# Altium schematic sheet MCU.SchDoc
size B; SheetNumber: 3; SheetTotal: 15; SPICEModelCacheWVSDJHDF: <root> / <DocumentId>WVSDJHDF</DocumentId> / </root>
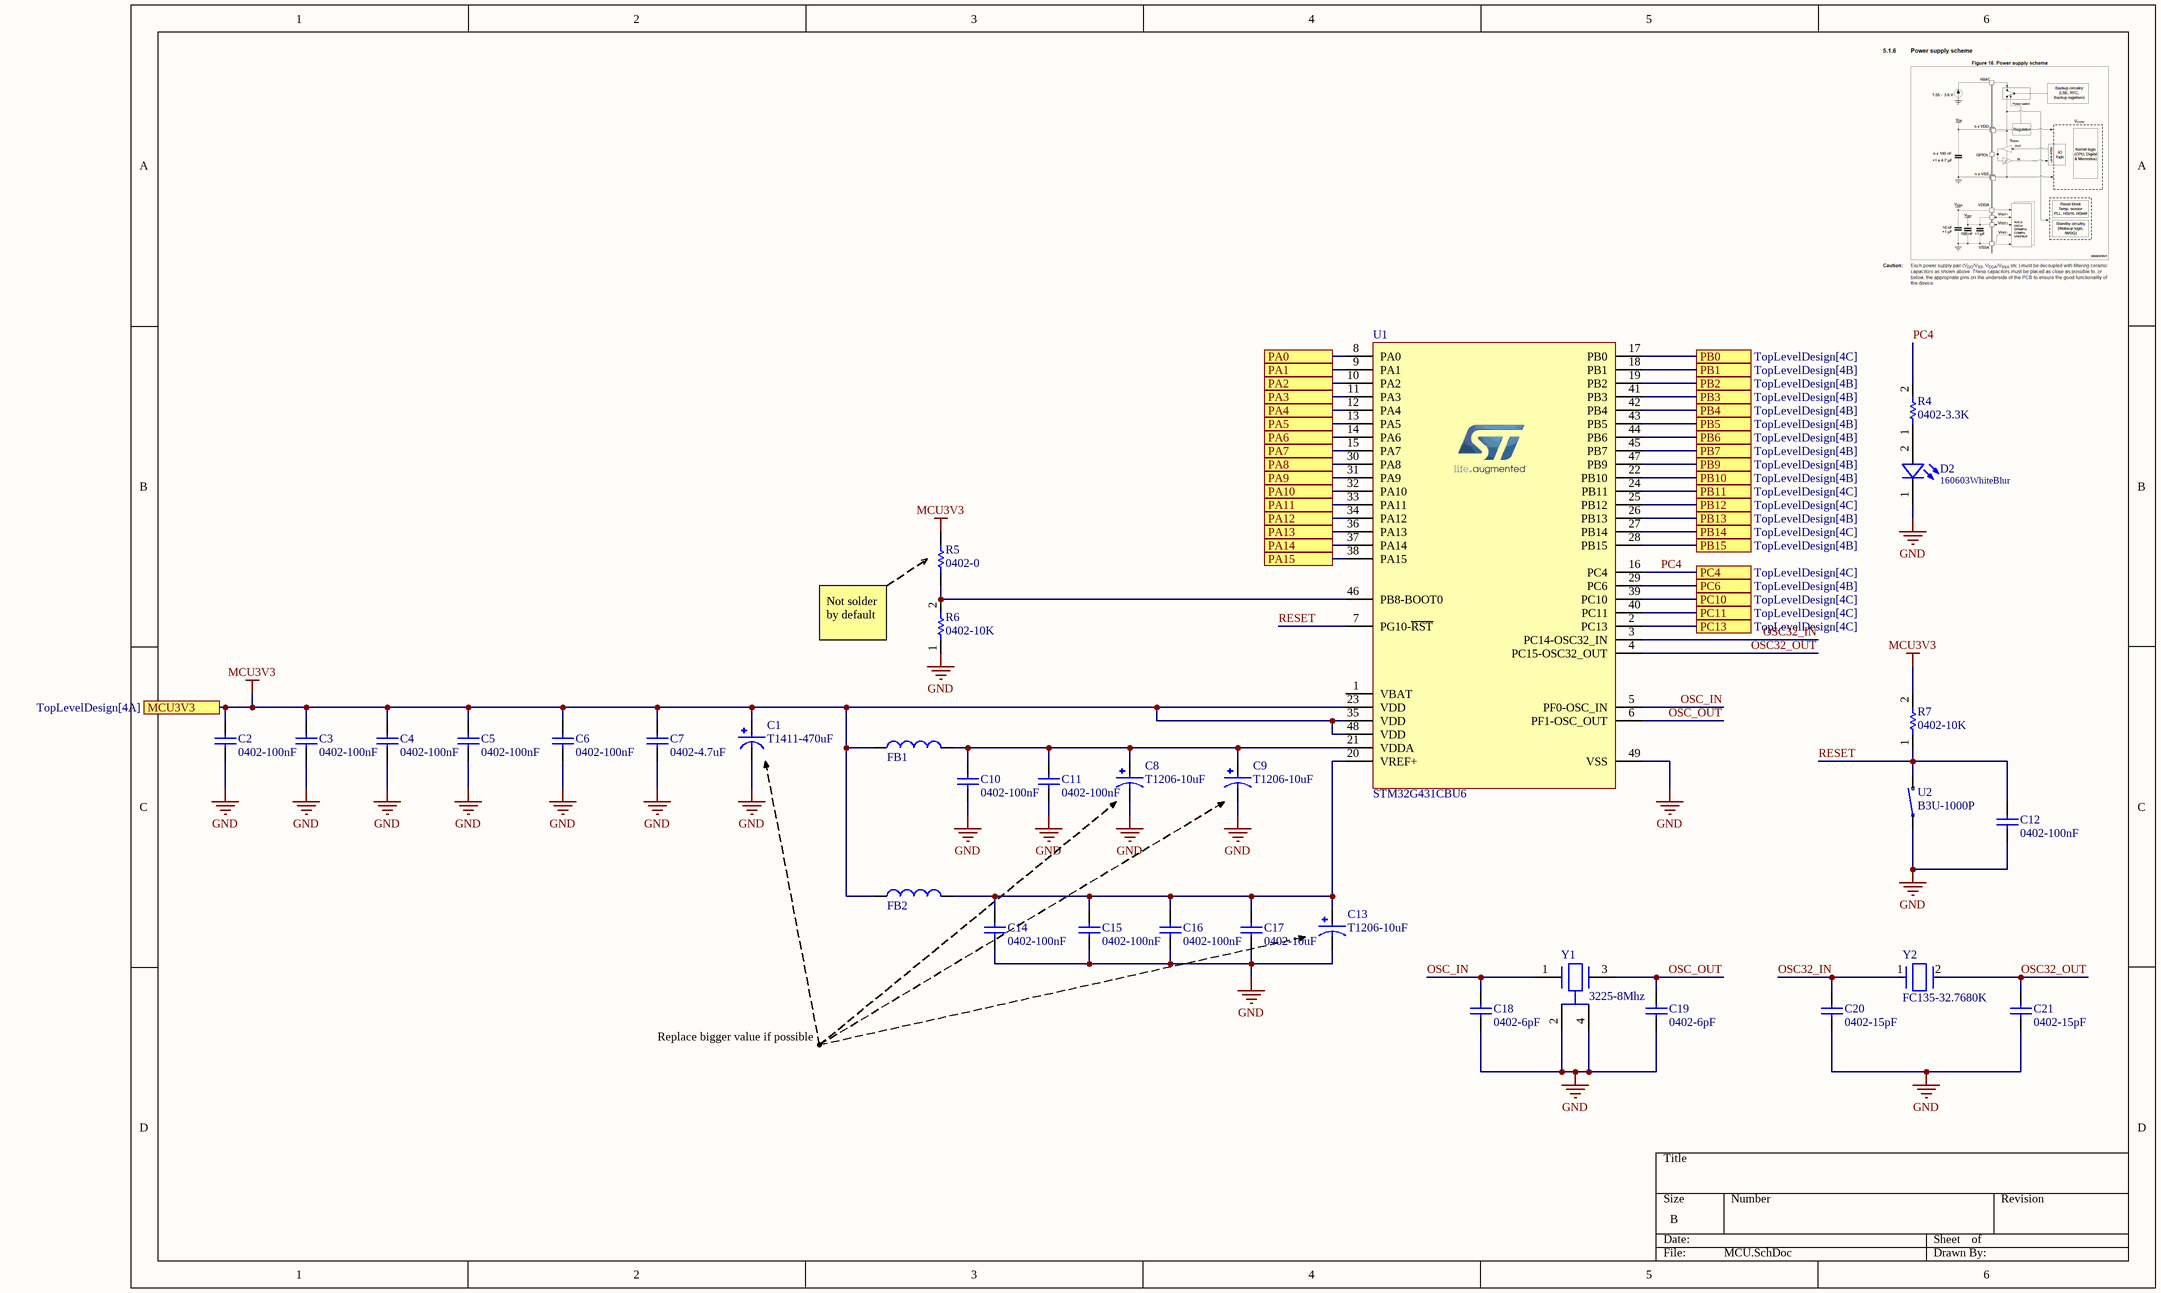
[diagram p0: MCU.SchDoc]

## Parts
C1  T1411-470uF  [CAPPC3528X210N]
C2  0402-100nF  [CAPC0402(1005)60_N]
C3  0402-100nF  [CAPC0402(1005)60_N]
C4  0402-100nF  [CAPC0402(1005)60_N]
C5  0402-100nF  [CAPC0402(1005)60_N]
C6  0402-100nF  [CAPC0402(1005)60_N]
C7  0402-4.7uF  [CAPC0402(1005)60_N]
C8  T1206-10uF  [CAPMP3216X180N]
C9  T1206-10uF  [CAPMP3216X180N]
C10  0402-100nF  [CAPC0402(1005)60_N]
C11  0402-100nF  [CAPC0402(1005)60_N]
C12  0402-100nF  [CAPC0402(1005)60_N]
C13  T1206-10uF  [CAPMP3216X180N]
C14  0402-100nF  [CAPC0402(1005)60_N]
C15  0402-100nF  [CAPC0402(1005)60_N]
C16  0402-100nF  [CAPC0402(1005)60_N]
C17  0402-10uF  [CAPC0402(1005)60_N]
C18  0402-6pF  [CAPC0402(1005)60_N]
C19  0402-6pF  [CAPC0402(1005)60_N]
C20  0402-15pF  [CAPC0402(1005)60_N]
C21  0402-15pF  [CAPC0402(1005)60_N]
D2  160603WhiteBlur  [WL-SMCW_0603_H=0.7mm]
FB1  03060360110225  [FER_0603]  (value not drawn)
FB2  03060360110225  [FER_0603]  (value not drawn)
R4  0402-3.3K  [R-0402-10K]
R5  0402-0  [R-0402-1K]
R6  0402-10K  [R-0402-10K]
R7  0402-10K  [R-0402-10K]
U1  STM32G431CBU6  [QFN50P700X700X60-49N]
U2  B3U-1000P  [SODFL4025X160N]
Y1  3225-8Mhz  [FP-NX3225SA-MFG]
Y2  FC135-32.7680K  [FP-FC-135-MFG]

## Ports
MCU3V3 (see TopLevelDesign[4A]), PA0 (see TopLevelDesign[4C]), PA1 (see TopLevelDesign[4C]), PA2 (see TopLevelDesign[4D]), PA3 (see TopLevelDesign[4D]), PA4 (see TopLevelDesign[4C]), PA5 (see TopLevelDesign[4C]), PA6 (see TopLevelDesign[4C]), PA7 (see TopLevelDesign[4C]), PA8 (see TopLevelDesign[4C]), PA9 (see TopLevelDesign[4C]), PA10 (see TopLevelDesign[4B]), PA11 (see TopLevelDesign[4B]), PA12 (see TopLevelDesign[4B]), PA13 (see TopLevelDesign[4B]), PA14 (see TopLevelDesign[4B]), PA15 (see TopLevelDesign[4B]), PB0 (see TopLevelDesign[4C]), PB1 (see TopLevelDesign[4B]), PB2 (see TopLevelDesign[4B]), PB3 (see TopLevelDesign[4B]), PB4 (see TopLevelDesign[4B]), PB5 (see TopLevelDesign[4B]), PB6 (see TopLevelDesign[4B]), PB7 (see TopLevelDesign[4B]), PB9 (see TopLevelDesign[4B]), PB10 (see TopLevelDesign[4B]), PB11 (see TopLevelDesign[4C]), PB12 (see TopLevelDesign[4C]), PB13 (see TopLevelDesign[4B]), PB14 (see TopLevelDesign[4C]), PB15 (see TopLevelDesign[4B]), PC4 (see TopLevelDesign[4C]), PC6 (see TopLevelDesign[4B]), PC10 (see TopLevelDesign[4C]), PC11 (see TopLevelDesign[4C]), PC13 (see TopLevelDesign[4C])

## Nets
GND: C1.2 C2.1 C3.1 C4.1 C5.1 C6.1 C7.1 C8.2 C9.2 C10.1 C11.1 C12.1 C13.2 C14.1 C15.1 C16.1 C17.1 C18.1 C19.1 C20.1 C21.1 D2.1(K) R6.1 U1.49(VSS) U2.1 Y1.2(GND) Y1.4(GND)
MCU3V3: C1.1 C2.2 C3.2 C4.2 C5.2 C6.2 C7.2 FB1.1 FB2.1 R5.2 R7.2 U1.23(VDD) U1.35(VDD) U1.48(VDD) ; port MCU3V3
OSC32_IN: C20.2 U1.3(PC14-OSC32_IN) Y2.1
OSC32_OUT: C21.2 U1.4(PC15-OSC32_OUT) Y2.2
OSC_IN: C18.2 U1.5(PF0-OSC_IN) Y1.1
OSC_OUT: C19.2 U1.6(PF1-OSC_OUT) Y1.3
PA0: U1.8(PA0) ; port PA0
PA1: U1.9(PA1) ; port PA1
PA2: U1.10(PA2) ; port PA2
PA3: U1.11(PA3) ; port PA3
PA4: U1.12(PA4) ; port PA4
PA5: U1.13(PA5) ; port PA5
PA6: U1.14(PA6) ; port PA6
PA7: U1.15(PA7) ; port PA7
PA8: U1.30(PA8) ; port PA8
PA9: U1.31(PA9) ; port PA9
PA10: U1.32(PA10) ; port PA10
PA11: U1.33(PA11) ; port PA11
PA12: U1.34(PA12) ; port PA12
PA13: U1.36(PA13) ; port PA13
PA14: U1.37(PA14) ; port PA14
PA15: U1.38(PA15) ; port PA15
PB0: U1.17(PB0) ; port PB0
PB1: U1.18(PB1) ; port PB1
PB2: U1.19(PB2) ; port PB2
PB3: U1.41(PB3) ; port PB3
PB4: U1.42(PB4) ; port PB4
PB5: U1.43(PB5) ; port PB5
PB6: U1.44(PB6) ; port PB6
PB7: U1.45(PB7) ; port PB7
PB9: U1.47(PB9) ; port PB9
PB10: U1.22(PB10) ; port PB10
PB11: U1.24(PB11) ; port PB11
PB12: U1.25(PB12) ; port PB12
PB13: U1.26(PB13) ; port PB13
PB14: U1.27(PB14) ; port PB14
PB15: U1.28(PB15) ; port PB15
PC4: R4.2 U1.16(PC4) ; port PC4
PC6: U1.29(PC6) ; port PC6
PC10: U1.39(PC10) ; port PC10
PC11: U1.40(PC11) ; port PC11
PC13: U1.2(PC13) ; port PC13
RESET: C12.2 R7.1 U1.7(PG10-~{RST}) U2.2
NetC8_1: C8.1 C9.1 C10.2 C11.2 FB1.2 U1.21(VDDA)
NetC13_1: C13.1 C14.2 C15.2 C16.2 C17.2 FB2.2 U1.20(VREF+)
NetD2_2: D2.2(A) R4.1
NetR5_1: R5.1 R6.2 U1.46(PB8-BOOT0)

Not connected (* = marked no-connect by the designer): U1 1(VBAT)

## Notes on the sheet
- Not solder by default
- Replace bigger value if possible

## Library data of the parts
C1 = CMP-001-00375-1: 470 µF Molded Tantalum Polymer Capacitor 25 V 1411 (3528 Metric), 1210 150mOhm @ 100kHz; Value: 470µF; MP: TCJB106M025R0150; MF: AVX; SnapEDA_Link: https://www.snapeda.com/parts/TCJB106M025R0150/AVX/view-part/?ref=snap; Check_prices: https://www.snapeda.com/parts/TCJB106M025R0150/AVX/view-part/?ref=eda; Pins: 2; Design Item ID: TCJB106M025R0150; Component Type: Standard; Source: TCJB106M025R0150.SchLib; Case/Package: 1210 AVX
C2-C6 C10-C12 C14-C16 = CMP-001-00354-3: Capacitor 100nF 0402; Tolerance: 20%; Voltage Rating (DC): 4V; Dielectric: X5R; Series: M; RoHS Compliant: Yes; Max Operating Temperature: 85°C; Length: 0.039inch; Thickness: 0.028inch; Mount: Surface Mount; Min Operating Temperature: -55°C; Height: 0.5mm; Packaging: Tape and Reel; Construction: Flat; Termination: SMD/SMT; Source: 0402-10uF.SchLib; Design Item ID: CMP-1034-02139-2; Case/Package: 0402; Voltage Rating: 4V; Pins: 2; Value: 100nF; Width: 0.02inch; Component Type: Standard; Package Quantity: 1; Halogen Free: Halogen Free; Case Code (Metric): 1005
C7 = CMP-001-00364-1: Capacitor 4.7uF 0402; Voltage Rating: 4V; Tolerance: 20%; Dielectric: X5R; Value: 4.7µF; Series: M; Width: 0.02inch; Halogen Free: Halogen Free; Construction: Flat; Pins: 2; Min Operating Temperature: -55°C; RoHS Compliant: Yes; Max Operating Temperature: 85°C; Thickness: 0.028inch; Package Quantity: 1; Mount: Surface Mount; Component Type: Standard; Packaging: Tape and Reel; Case Code (Metric): 1005; Case/Package: 0402; Voltage Rating (DC): 4V; Length: 0.039inch; Source: 0402-10uF.SchLib; Termination: SMD/SMT; Design Item ID: CMP-1034-02139-2; Height: 0.5mm
C8 C9 C13 = CMP-001-00370-3: Tantalum Capacitors - Polymer SMD 6.3V 47uF 1206 10% ESR=150mOhms; MP: T543A476K006ATW150; MF: KEMET; Value: 10µF; Source: T543A476K006ATW150.SchLib; Design Item ID: T543A476K006ATW150; Check_prices: https://www.snapeda.com/parts/T543A476K006ATW150/KEMET/view-part/?ref=eda; Case/Package: SMD-2 Kemet; Component Type: Standard; SnapEDA_Link: https://www.snapeda.com/parts/T543A476K006ATW150/KEMET/view-part/?ref=snap; Pins: 2
C17 = CMP-001-00352-3: Capacitor 10uF 0402s; Tolerance: 20%; Value: 10µF; Dielectric: X5R; Voltage Rating (DC): 4V; Width: 0.02inch; Packaging: Tape and Reel; RoHS Compliant: Yes; Series: M; Mount: Surface Mount; Termination: SMD/SMT; Source: 0402-10uF.SchLib; Design Item ID: CMP-1034-02139-2; Min Operating Temperature: -55°C; Construction: Flat; Component Type: Standard; Case Code (Metric): 1005; Length: 0.039inch; Height: 0.5mm; Pins: 2; Thickness: 0.028inch; Voltage Rating: 4V; Package Quantity: 1; Max Operating Temperature: 85°C; Halogen Free: Halogen Free; Case/Package: 0402
C18 C19 = CMP-001-00362-3: Capacitor 6pF 0402; Dielectric: X5R; Voltage Rating: 4V; Tolerance: 20%; Source: 0402-10uF.SchLib; Case Code (Metric): 1005; Case/Package: 0402; Mount: Surface Mount; Component Type: Standard; Packaging: Tape and Reel; Construction: Flat; RoHS Compliant: Yes; Series: M; Width: 0.02inch; Max Operating Temperature: 85°C; Min Operating Temperature: -55°C; Pins: 2; Height: 0.5mm; Package Quantity: 1; Length: 0.039inch; Thickness: 0.028inch; Value: 6pF; Design Item ID: CMP-1034-02139-2; Halogen Free: Halogen Free; Termination: SMD/SMT; Voltage Rating (DC): 4V
C20 C21 = CMP-001-00374-1: Capacitor 15pF 0402; Voltage Rating: 4V; Tolerance: 20%; Dielectric: X5R; Packaging: Tape and Reel; Length: 0.039inch; Max Operating Temperature: 85°C; Design Item ID: CMP-1034-02139-2; Value: 15pF; Min Operating Temperature: -55°C; Case Code (Metric): 1005; Voltage Rating (DC): 4V; Case/Package: 0402; RoHS Compliant: Yes; Height: 0.5mm; Halogen Free: Halogen Free; Construction: Flat; Thickness: 0.028inch; Component Type: Standard; Source: 0402-10uF.SchLib; Termination: SMD/SMT; Mount: Surface Mount; Width: 0.02inch; Pins: 2; Series: M; Package Quantity: 1
D2 = CMP-004-00095-1: WL-SMCW SMT Mono-color Chip LED Blur, size 0603, White; ComponentLink3Description: Supplier 2 URL; Design Item ID: 160603WhiteBlur; Component Type: Standard; Size: 0603; Supplier 1 SN: 755-SMLEN3WBC8W1; Color: White; Supplier 3 Name: ICDayRoi; Supplier 3 URL: N/A; Pins: 2; Supplier 2 URL: https://www.digikey.com/en/products/detail/qt-brightek-qtb/QBLP601-IW/4814655; ComponentLink1URL: N/A; ComponentLink3URL: https://www.digikey.com/en/products/detail/qt-brightek-qtb/QBLP601-IW/4814655; Supplier 1 URL: https://www.mouser.vn/ProductDetail/ROHM-Semiconductor/SMLEN3WBC8W1?qs=W0yvOO0ixfGun78rr9Unsw%3D%3D; ComponentLink2URL: https://www.mouser.vn/ProductDetail/ROHM-Semiconductor/SMLEN3WBC8W1?qs=W0yvOO0ixfGun78rr9Unsw%3D%3D; ComponentLink4Description: Supplier 3 URL; Supplier 1 Name: Mouser; Supplier 3 SN: N/A; ComponentLink4URL: N/A; Source: WL-SMCW_0603.SchLib; Supplier 2 SN: 1516-1057-2-ND; Value: White; Supplier 2 Name: Digi-Key; ComponentLink2Description: Supplier 1 URL; ComponentLink1Description: Datasheet link; Type: Blur
FB1 FB2 = CMP-006-00090-1: Ferrite, 0603, 600 Ohms, 300 mA; Manufacture Name: Wurth Elektronik; Manufacture SN: 742792651; Maximum DC Resistance: 200 mOhms; Maximum DC Current: 1 A; Test Frequency: 100MHz; Tolerance: 25%; Design Item ID: 03060360110225; Impedance: 600 Ohms; Supplier 2 URL: N/A; Supplier 1 URL: https://www.mouser.com/ProductDetail/Wurth-Elektronik/742792651?qs=sGAEpiMZZMt1hubY80%2Fs8M60rIzA20dgTaAssd1%2FEf4%3D&utm_source=mouser-refine-download&utm_medium=file&utm_campaign=742792651&utm_content=Wurth-Elektronik; Supplier 1 SN: 710-742792651; Size: 0603; Operating Temperature: -55 to +125degC; Supplier 1 Name: Mouser; Packaging: Tape and Reel; Pins: 2; Supplier 2 SN: N/A; Supplier 3 Name: thegioiic; Supplier 3 URL: N/A; Supplier 2 Name: Digi-Key; Source: Ferrite_Bead_0603.SchLib; Mounting Technology: SMT; Supplier 3 SN: N/A; Component Type: Standard
R4 = CMP-009-00688-1: RES 0402 3.3K; Value: 3.3k
R5 = CMP-009-00678-4: 0402Resistor 0 Ohm; Value: 0
R6 R7 = CMP-009-00675-4: RES 0402 10K; Value: 10k
U1 = CMP-031-00017-3: ARMÂ® CortexÂ®-M4F STM32G4 Microcontroller IC 32-Bit Single-Core 170MHz 128KB (128K x 8) FLASH 48-UFQFPN (7x7); MF: STMicroelectronics; Case/Package: UFQFPN-48 STMicroelectronics; MP: STM32G431CBU6; Check_prices: https://www.snapeda.com/parts/STM32G431CBU6/STMicroelectronics/view-part/?ref=eda; Source: STM32G431CBU6.SchLib; Pins: 49; Value: *; SnapEDA_Link: https://www.snapeda.com/parts/STM32G431CBU6/STMicroelectronics/view-part/?ref=snap; Design Item ID: STM32G431CBU6; Component Type: Standard
U2 = CMP-011-00123-3: Switch Tactile N.O. SPST Round Button Gull Wing 0.05A 12VDC 1.5N SMD T/R; MP: B3U1000P; MF: Omron; Design Item ID: B3U-1000P; Value: *; Component Type: Standard; Check_prices: https://www.snapeda.com/parts/B3U1000P/Omron/view-part/?ref=eda; SnapEDA_Link: https://www.snapeda.com/parts/B3U1000P/Omron/view-part/?ref=snap; Pins: 2; Case/Package: None; Source: B3U-1000P.SchLib
Y1 = CMP-003-00059-1: CRYSTAL 8MHZ 8PF SMD; Manufacturer: NDK; Manufacturer Part Number: NX3225SA-25.000M-STD-CRS-2; Automotive Grade: Grade 1; Tolerance: 15ppm; Esr: 100; Series: NX3225SA; Device Class L2: Crystals / Oscillators; Temperature Range High: 125°C; Category: Crys; Height: 0.6mm; Device Class L3: Crystals; Device Class L1: Passive Components; Load Capacitance: 8pF; Octopart: https://octopart.com/nx3225sa-25.000m-std-crs-2-ndk-51374293; Automotive: Yes; Temperature: -40°C to +125°C; Component Type: Standard; Source: Components - 28.03.25 - 23.15.SchLib; Digikey Description: CRYSTAL 40MHZ 8PF SMD; Design Item ID: CMP-200220-000002-1; Temperature Range Low: -40°C; Frequency: 8MHz; Case/Package: NX3225SA; RoHS: TRUE; Pins: 4; Lead Free: Yes
Y2 = CMP-003-00053-1: Parallel - Fundamental Quartz Crystal, 0.032768MHz Nom; Frequency Stability: 0.0144%; Load Capacitance: 12.5pF; Frequency Tolerance: 20ppm; Min Operating Temperature: -40°C; Max Operating Temperature: 85°C